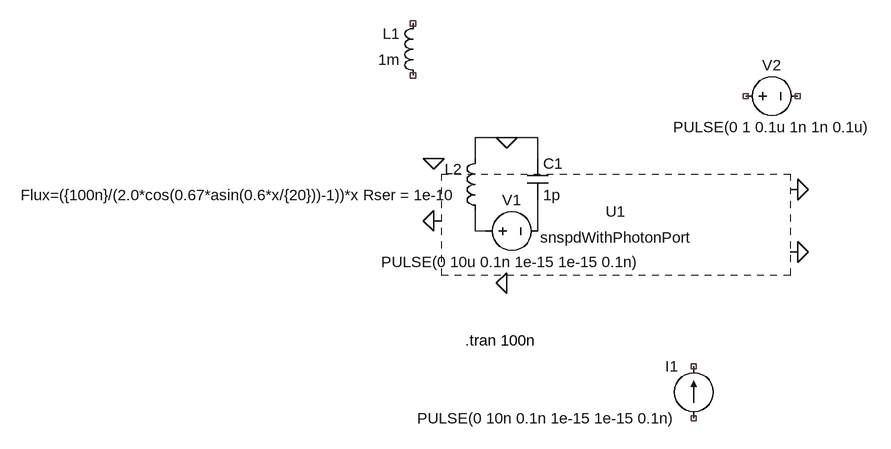
[diagram p0: schematic trapz_vs_gear.asc]
trapz_vs_gear.asc, the LTspice schematic file:
Version 4
SHEET 1 900 680
WIRE 336 176 288 176
WIRE 384 176 336 176
WIRE 288 208 288 176
WIRE 384 208 384 176
WIRE 288 320 288 288
WIRE 304 320 288 320
WIRE 384 320 384 272
FLAG 336 176 0
FLAG 224 304 0
FLAG 224 208 0
FLAG 336 400 0
FLAG 784 352 0
FLAG 784 256 0
SYMBOL ind 208 96 R180
WINDOW 0 36 80 Left 2
WINDOW 3 36 40 Left 2
SYMATTR InstName L1
SYMATTR Value 1m
SYMBOL Cap 368 208 R0
SYMATTR InstName C1
SYMATTR Value 1p
SYMBOL Voltage 288 320 R270
WINDOW 0 32 56 VTop 2
WINDOW 3 -32 56 VBottom 2
SYMATTR InstName V1
SYMATTR Value PULSE(0 10u 0.1n 1e-15 1e-15 0.1n)
SYMBOL qnn-spice/SNSPD/snspdWithPhotonPort 848 304 R0
SYMATTR InstName U1
SYMBOL current 624 608 R180
WINDOW 0 24 80 Left 2
WINDOW 3 24 0 Left 2
SYMATTR InstName I1
SYMATTR Value PULSE(0 10n 0.1n 1e-15 1e-15 0.1n)
SYMBOL Voltage 688 112 R270
WINDOW 0 32 56 VTop 2
WINDOW 3 -32 56 VBottom 2
SYMATTR InstName V2
SYMATTR Value PULSE(0 1 0.1u 1n 1n 0.1u)
SYMBOL ind 304 304 R180
WINDOW 0 36 80 Left 2
WINDOW 3 36 40 Left 2
SYMATTR InstName L2
SYMATTR Value Flux=({100n}/(2.0*cos(0.67*asin(0.6*x/{20}))-1))*x Rser = 1e-10
TEXT 272 488 Left 2 !.tran 100n

The netlist it stands for:
* trapz_vs_gear.asc
L1 NC_01 NC_02 1m
C1 0 N002 1p
V1 N001 N002 PULSE(0 10u 0.1n 1e-15 1e-15 0.1n)
* U1: snspdWithPhotonPort (symbol qnn-spice/SNSPD/snspdWithPhotonPort not available, pin order unknown); nets seen at it: 0
I1 NC_03 NC_04 PULSE(0 10n 0.1n 1e-15 1e-15 0.1n)
V2 NC_05 NC_06 PULSE(0 1 0.1u 1n 1n 0.1u)
L2 N001 0 Flux=({100n}/(2.0*cos(0.67*asin(0.6*x/{20}))-1))*x Rser = 1e-10
.tran 100n
.backanno
.end